# Altium schematic sheet TE0747.SchDoc
size A4
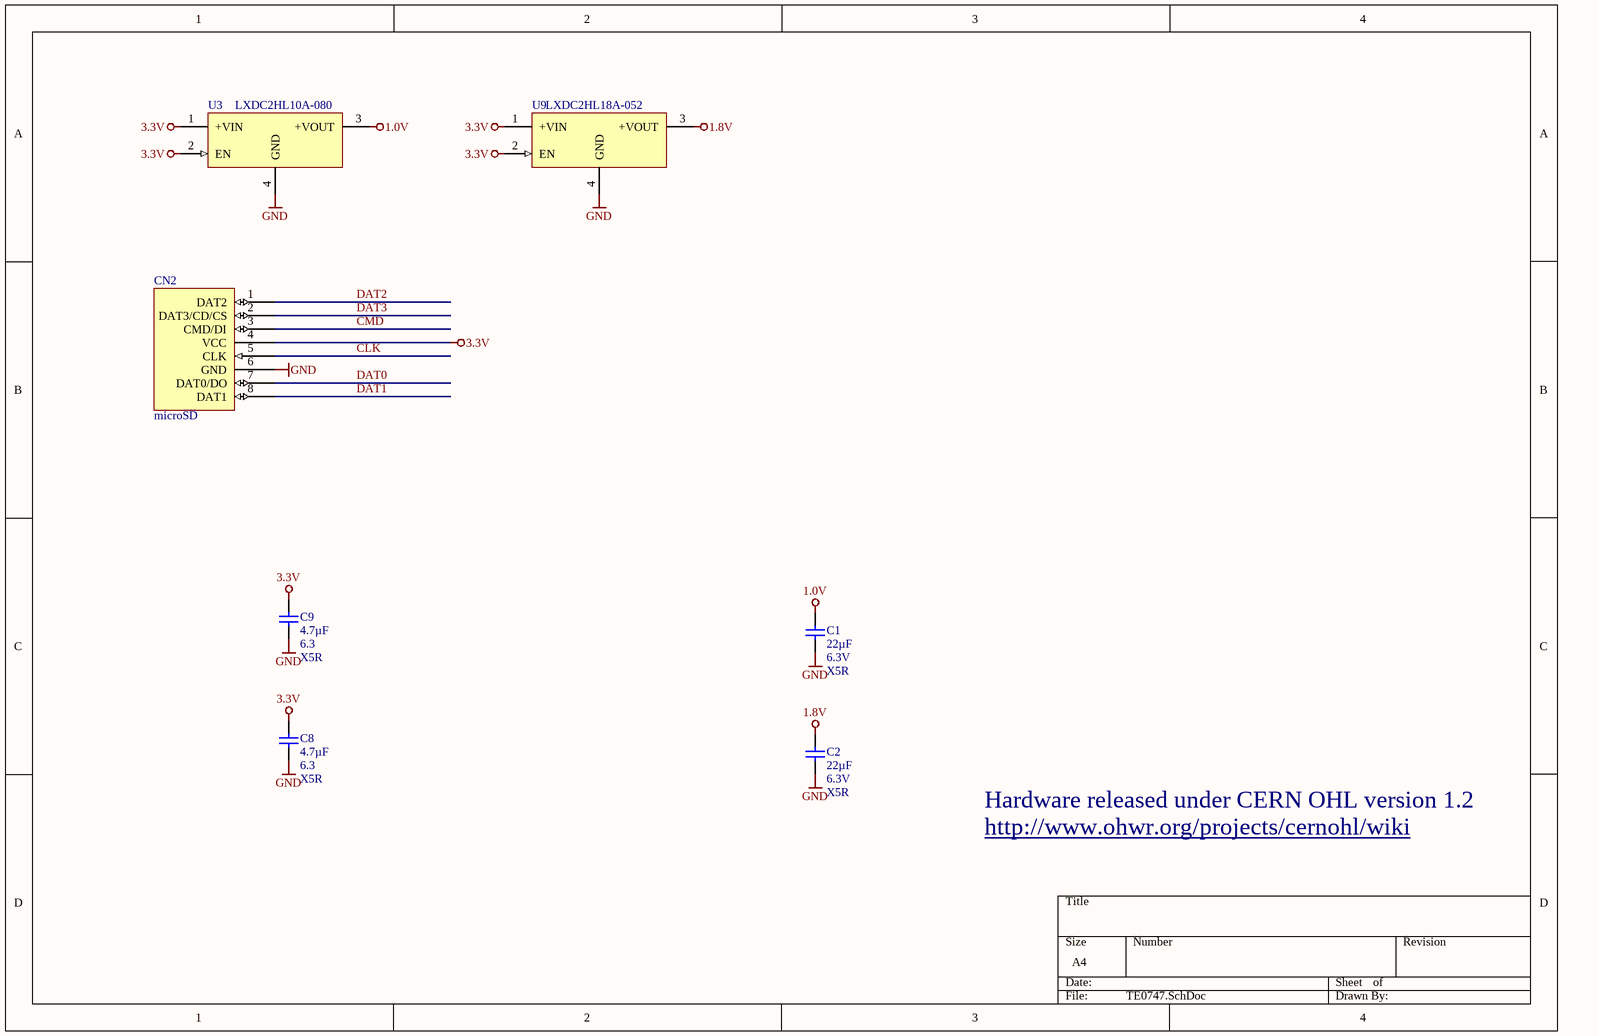
[diagram p0: TE0747.SchDoc]

## Parts
C1  22µF  Voltage: 6.3V  Technology: X5R  [CAPC1608X90N]
C2  22µF  Voltage: 6.3V  Technology: X5R  [CAPC1608X90N]
C8  4.7µF  Voltage: 6.3  Technology: X5R  [CAPC1005X60N]
C9  4.7µF  Voltage: 6.3  Technology: X5R  [CAPC1005X60N]
CN2  microSD  [uSD_PCB]
U3  LXDC2HL10A-080  [LXDC2HL]
U9  LXDC2HL18A-052  [LXDC2HL]

## Nets
1.0V: C1.1 U3.3(+VOUT)
1.8V: C2.1 U9.3(+VOUT)
3.3V: C8.1 C9.1 CN2.4(VCC) U3.1(+VIN) U3.2(EN) U9.1(+VIN) U9.2(EN)
GND: C1.2 C2.2 C8.2 C9.2 CN2.6(GND) U3.4(GND) U9.4(GND)
CLK: CN2.5(CLK)
CMD: CN2.3(CMD/DI)
DAT0: CN2.7(DAT0/DO)
DAT1: CN2.8(DAT1)
DAT2: CN2.1(DAT2)
DAT3: CN2.2(DAT3/CD/CS)

## Notes on the sheet
- Hardware released under CERN OHL version 1.2
- http://www.ohwr.org/projects/cernohl/wiki

## Library data of the parts
C1 C2 = 25400: KON 22µF 6,3V X5R SMD; AN: 25400; Mixed: SMT; Value: 22u; Case: 1608 (0603)
C8 C9 = 24719: KON 4.7µF 6.3V X5R SMD 20%; AN: 24719; Mixed: SMT; Value: 4.7u; Preferred: Yes; Case: 1005 (0402); Tolerance: 20%
CN2 = microSD_pads
U3 = 26786: AN: 26786; Mixed: SMT; Trenz-Stock: Yes; HelpURL: B:\AD\adlib\datasheet\LXDC2HL
U9 = 26785: AN: 26785; Mixed: SMT; Trenz-Stock: Yes; HelpURL: B:\AD\adlib\datasheet\LXDC2HL